# EAGLE schematic sonda4 (EAGLE 4.16)
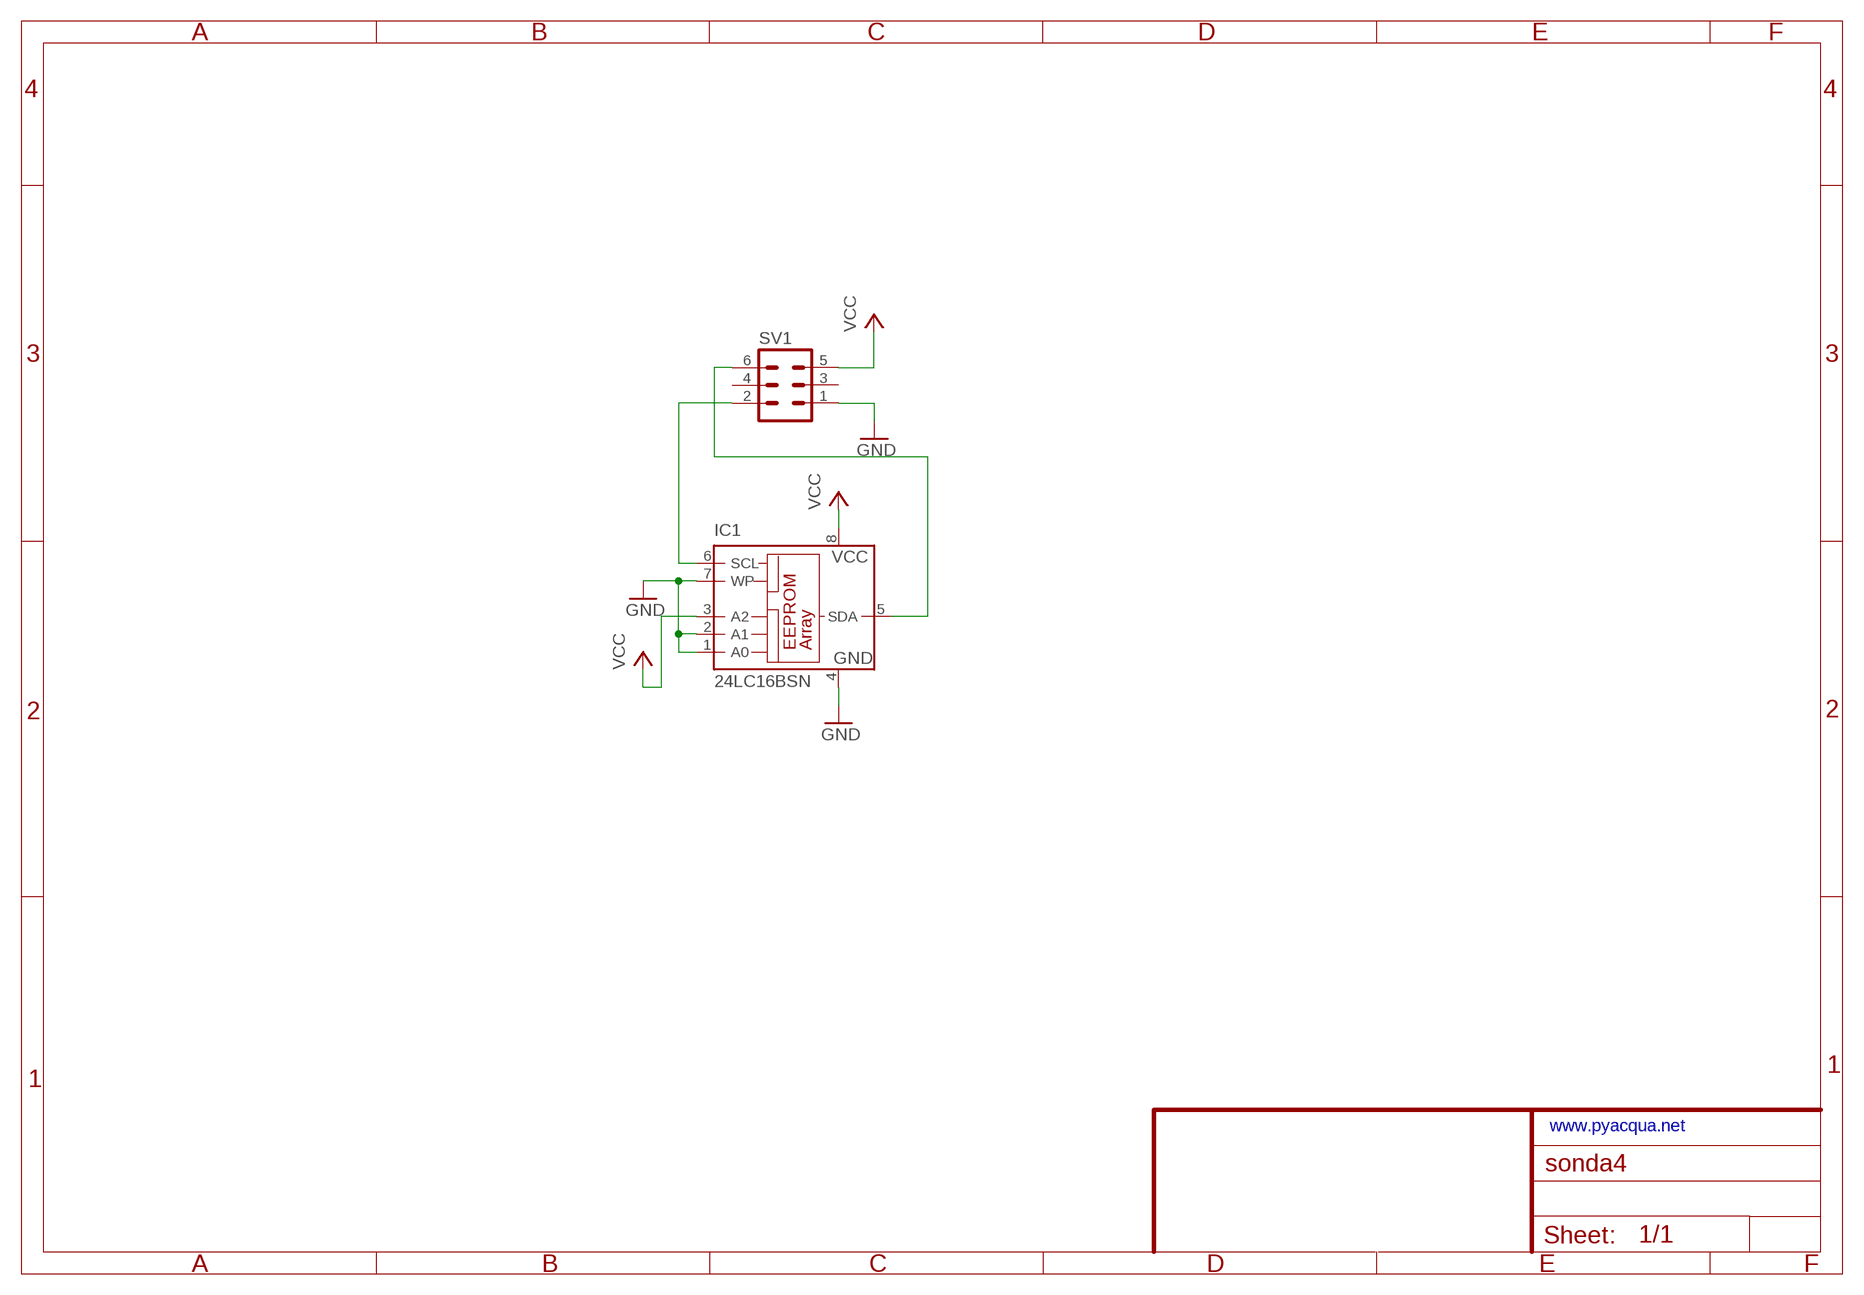
[diagram p0: schematic, sheet 1]

## Parts
IC1  24LC16BSN  [SO-08]
SV1  MA03-2  [MA03-2]

## Nets
GND: IC1.1(A0) IC1.2(A1) IC1.4(GND) IC1.7(WP) SV1.1
N$1: IC1.6(SCL) SV1.2
N$2: IC1.5(SDA) SV1.6
VCC: IC1.3(A2) IC1.8(VCC) SV1.5
Unconnected: SV1.3 SV1.4

## Notes on the sheet
- www.pyacqua.net

## Library data of the parts
IC1 = microchip:24*: Serial EEPROM I2C
SV1 = con-lstb:MA03-2: PIN HEADER